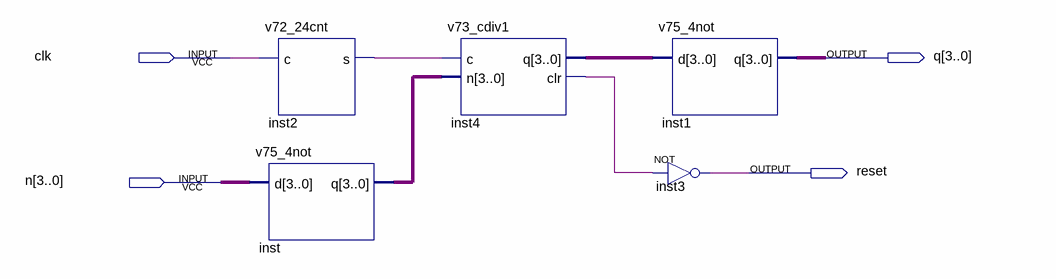
[diagram p0: schematic sheet]
// Quartus schematic s75_counters.bdf as structural Verilog: 5 symbols, 4 pins
module s75_counters (
  input  clk,
  input  [3:0] n,
  output [3:0] q,
  output reset
);

  wire inst2_s, inst4_clr;
  wire [3:0] inst4_q, inst_q;

  v72_24cnt inst2 (.c(clk), .s(inst2_s));
  v75_4not inst (.d(n), .q(inst_q));
  v73_cdiv1 inst4 (.c(inst2_s), .n(inst_q), .q(inst4_q), .clr(inst4_clr));
  v75_4not inst1 (.d(inst4_q), .q(q));
  not inst3 (reset, inst4_clr);
endmodule
